# Altium schematic sheet OpenPack_BATMOD_V1p0_FRP.SchDoc
size A4; DocumentNumber: 1; SheetNumber: 1; SheetTotal: 10; Title_: Front Page
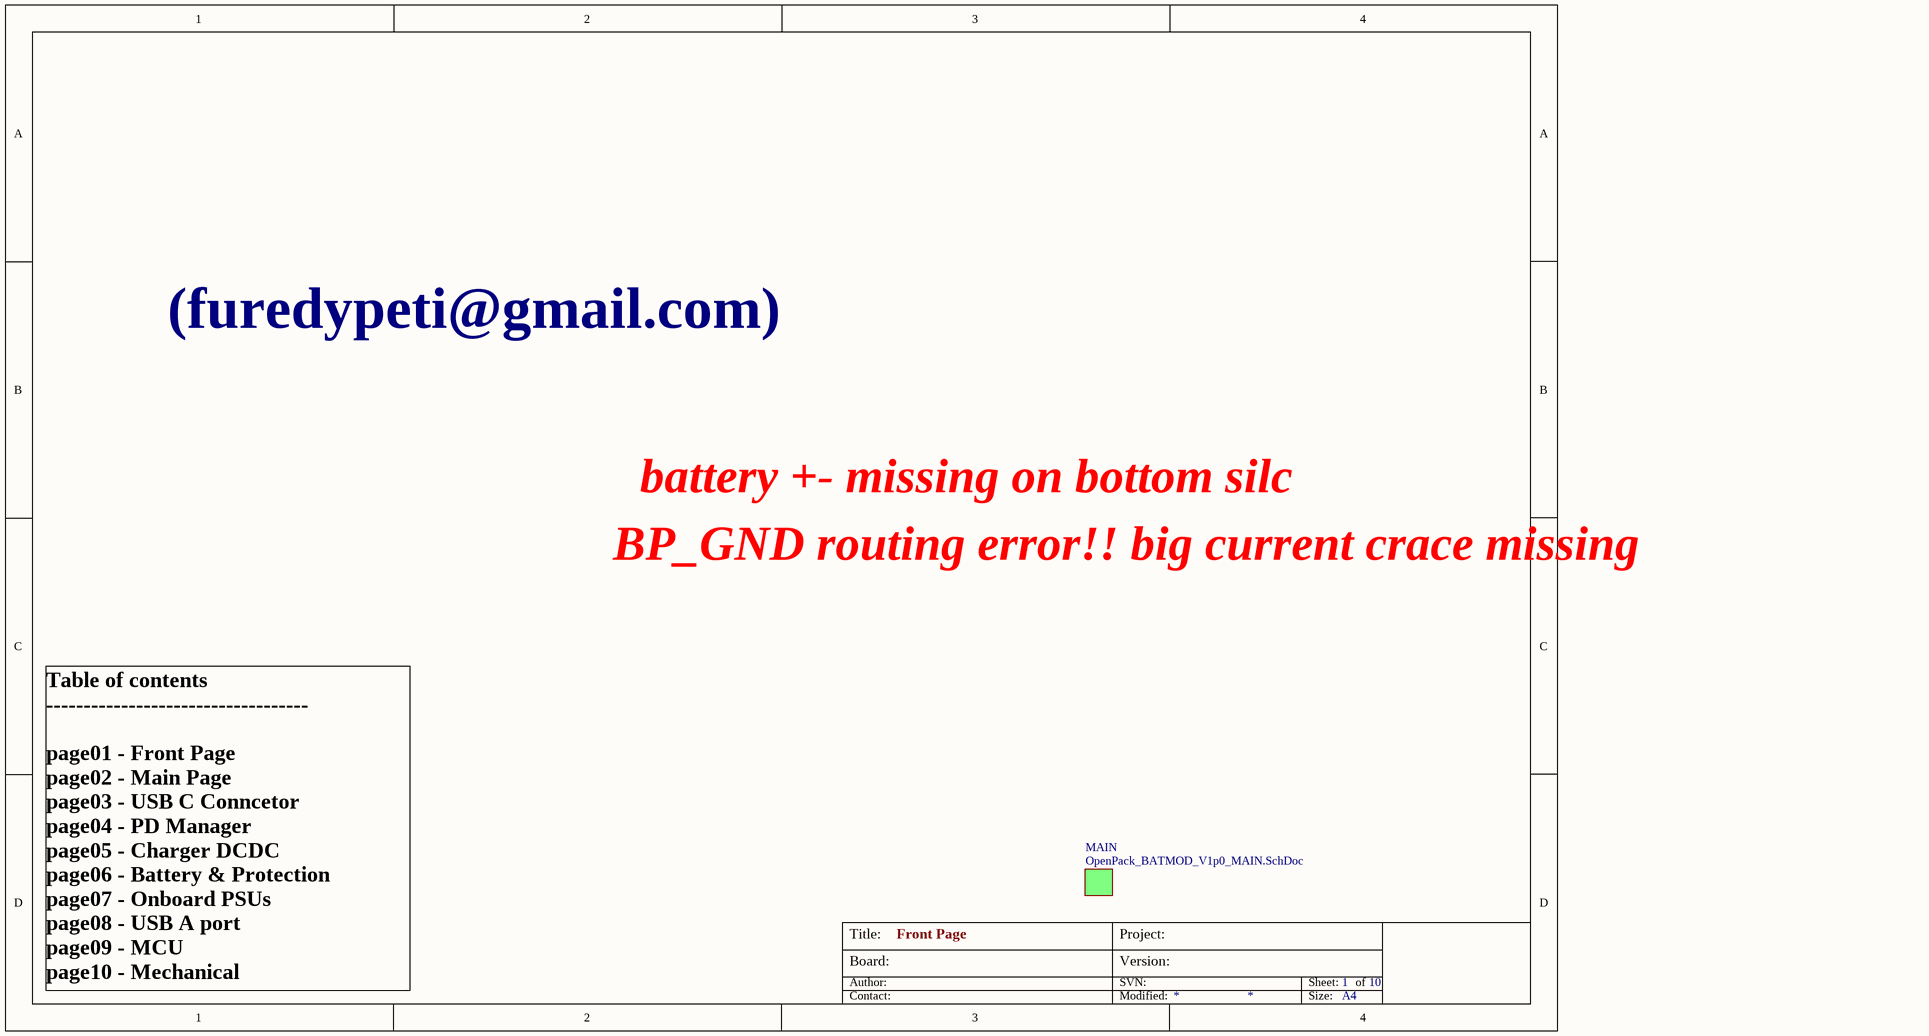
[diagram p0: OpenPack_BATMOD_V1p0_FRP.SchDoc]

## Sub-sheets
MAIN = OpenPack_BATMOD_V1p0_MAIN.SchDoc: no entries

## Notes on the sheet
- (furedypeti@gmail.com)
- battery +- missing on bottom silc
- BP_GND routing error!! big current crace missing
- Table of contents
  -----------------------------------
  page01 - Front Page
  page02 - Main Page
  page03 - USB C Conncetor
  page04 - PD Manager
  page05 - Charger DCDC
  page06 - Battery & Protection
  page07 - Onboard PSUs
  page08 - USB A port
  page09 - MCU
  page10 - Mechanical
- Board:
- Author:
- Title:
- Project:
- SVN:
- Version:
- Sheet:
- of
- Contact:
- Modified:
- Size:
- A4